# EAGLE schematic OutputBoard (EAGLE 7.1.0)
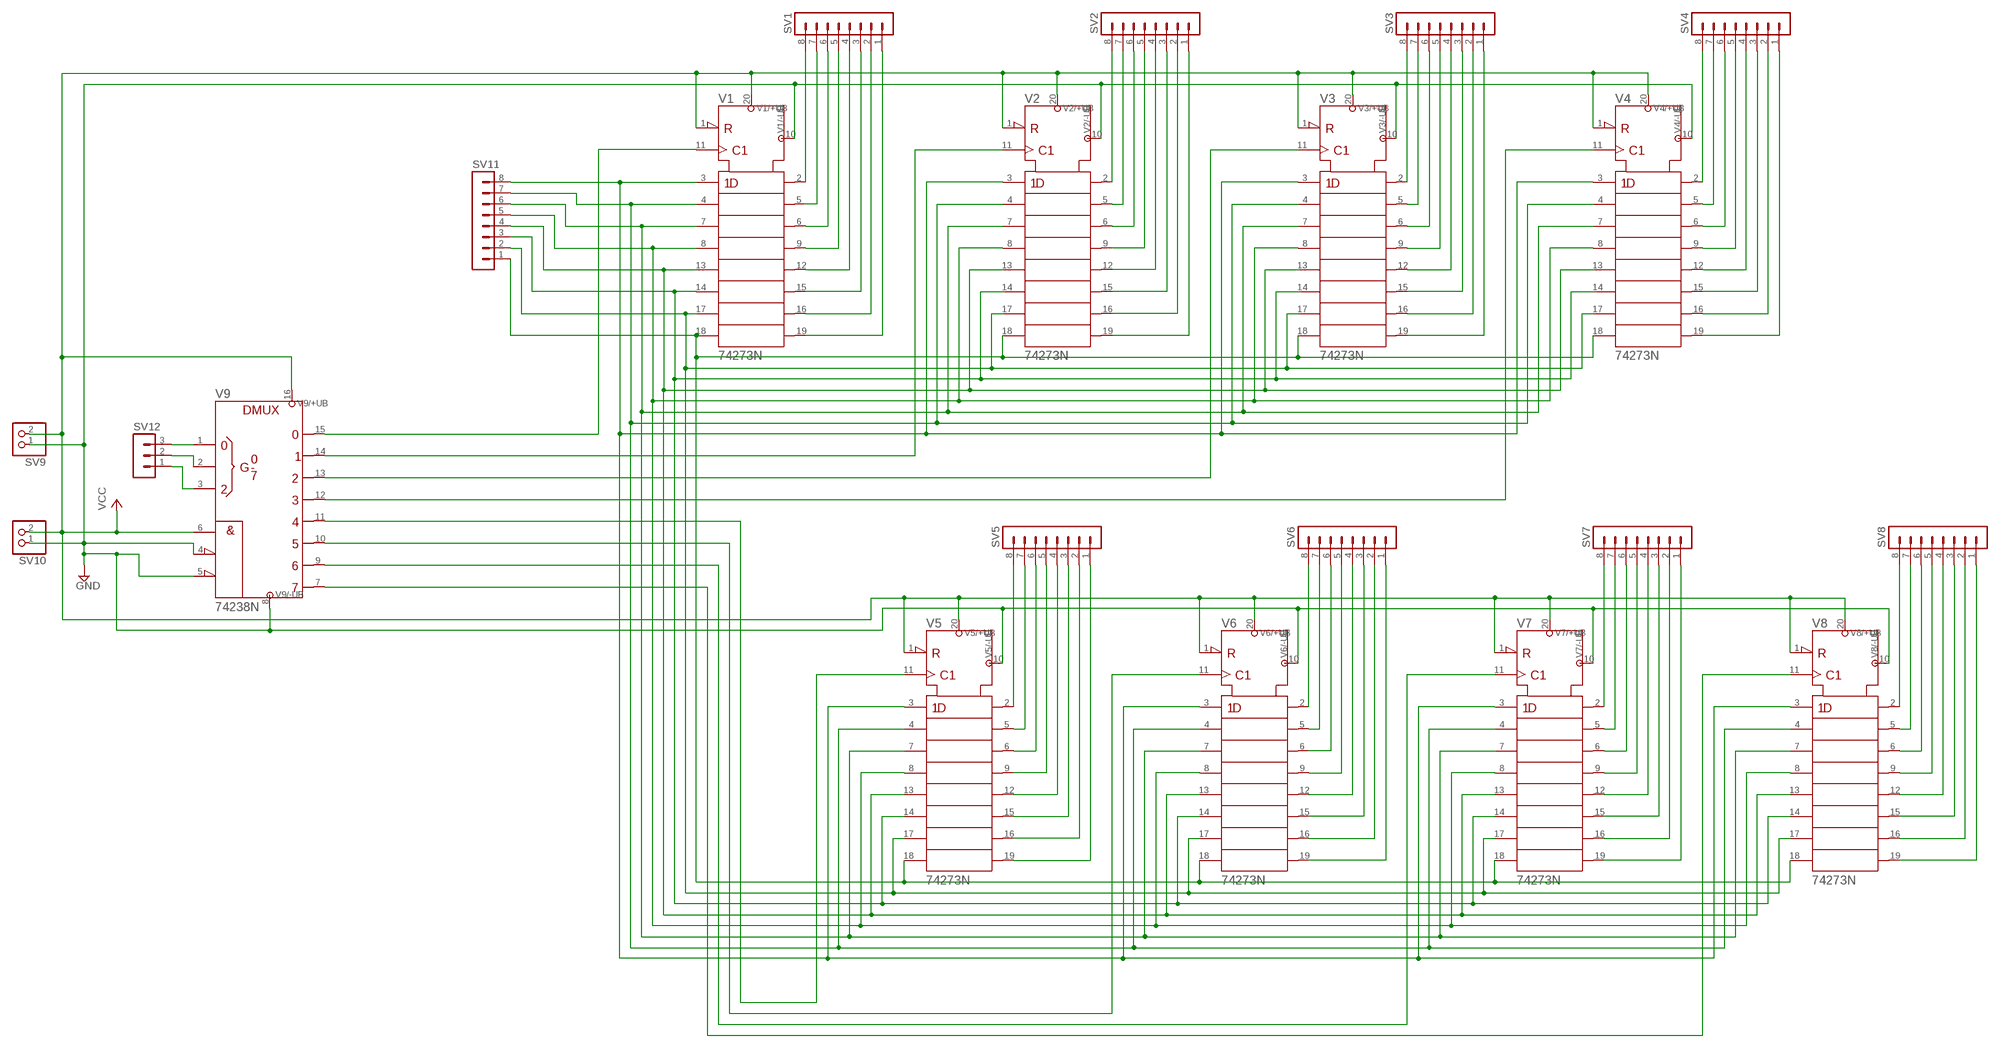
[diagram p0: schematic, sheet 1]

## Parts
SV1  MA08-1  [MA08-1]
SV2  MA08-1  [MA08-1]
SV3  MA08-1  [MA08-1]
SV4  MA08-1  [MA08-1]
SV5  MA08-1  [MA08-1]
SV6  MA08-1  [MA08-1]
SV7  MA08-1  [MA08-1]
SV8  MA08-1  [MA08-1]
SV9  PINHD-1X2  [1X02]
SV10  PINHD-1X2  [1X02]
SV11  MA08-1  [MA08-1]
SV12  MA03-1  [MA03-1]
V1  74273N  [DIL20]
V2  74273N  [DIL20]
V3  74273N  [DIL20]
V4  74273N  [DIL20]
V5  74273N  [DIL20]
V6  74273N  [DIL20]
V7  74273N  [DIL20]
V8  74273N  [DIL20]
V9  74238N  [DIL16]

## Nets
BUS1: SV11.8 V1.3(1D) V2.3(1D) V3.3(1D) V4.3(1D) V5.3(1D) V6.3(1D) V7.3(1D) V8.3(1D)
DATA1: SV11.1 V1.18(8D) V2.18(8D) V3.18(8D) V4.18(8D) V5.18(8D) V6.18(8D) V7.18(8D) V8.18(8D)
DATA2: SV11.2 V1.17(7D) V2.17(7D) V3.17(7D) V4.17(7D) V5.17(7D) V6.17(7D) V7.17(7D) V8.17(7D)
DATA3: SV11.3 V1.14(6D) V2.14(6D) V3.14(6D) V4.14(6D) V5.14(6D) V6.14(6D) V7.14(6D) V8.14(6D)
DATA8: SV11.4 V1.13(5D) V2.13(5D) V3.13(5D) V4.13(5D) V5.13(5D) V6.13(5D) V7.13(5D) V8.13(5D)
GND [Ground]: SV9.1 SV10.1 V1.10(-UB) V2.10(-UB) V3.10(-UB) V4.10(-UB) V5.10(-UB) V6.10(-UB) V7.10(-UB) V8.10(-UB) V9.4(!G2A) V9.5(!G2B) V9.8(-UB)
N$1: V3.11(CLK) V9.13(Y2)
N$2: SV2.8 V2.2(1Q)
N$3: V1.11(CLK) V9.15(Y0)
N$4: V2.11(CLK) V9.14(Y1)
N$5: SV2.7 V2.5(2Q)
N$6: SV2.6 V2.6(3Q)
N$7: SV2.5 V2.9(4Q)
N$8: SV2.4 V2.12(5Q)
N$9: SV2.3 V2.15(6Q)
N$10: SV2.2 V2.16(7Q)
N$11: SV2.1 V2.19(8Q)
N$12: SV1.8 V1.2(1Q)
N$13: SV12.2 V9.2(B)
N$14: SV12.1 V9.3(C)
N$15: SV5.8 V5.2(1Q)
N$16: SV1.7 V1.5(2Q)
N$17: SV1.6 V1.6(3Q)
N$18: SV1.5 V1.9(4Q)
N$19: SV1.4 V1.12(5Q)
N$20: SV12.3 V9.1(A)
N$21: SV5.7 V5.5(2Q)
N$22: SV5.6 V5.6(3Q)
N$23: SV1.3 V1.15(6Q)
N$24: SV1.2 V1.16(7Q)
N$25: SV1.1 V1.19(8Q)
N$26: V4.11(CLK) V9.12(Y3)
N$27: V5.11(CLK) V9.11(Y4)
N$28: V6.11(CLK) V9.10(Y5)
N$29: SV11.7 V1.4(2D) V2.4(2D) V3.4(2D) V4.4(2D) V5.4(2D) V6.4(2D) V7.4(2D) V8.4(2D)
N$30: SV3.8 V3.2(1Q)
N$31: SV3.7 V3.5(2Q)
N$32: SV3.6 V3.6(3Q)
N$33: SV3.5 V3.9(4Q)
N$34: SV3.4 V3.12(5Q)
N$35: SV3.3 V3.15(6Q)
N$36: SV3.2 V3.16(7Q)
N$37: SV3.1 V3.19(8Q)
N$38: SV4.8 V4.2(1Q)
N$39: SV4.7 V4.5(2Q)
N$40: SV4.6 V4.6(3Q)
N$41: SV4.5 V4.9(4Q)
N$42: SV4.4 V4.12(5Q)
N$43: SV4.3 V4.15(6Q)
N$44: SV4.2 V4.16(7Q)
N$45: SV4.1 V4.19(8Q)
N$46: SV11.6 V1.7(3D) V2.7(3D) V3.7(3D) V4.7(3D) V5.7(3D) V6.7(3D) V7.7(3D) V8.7(3D)
N$47: SV11.5 V1.8(4D) V2.8(4D) V3.8(4D) V4.8(4D) V5.8(4D) V6.8(4D) V7.8(4D) V8.8(4D)
N$48: SV6.8 V6.2(1Q)
N$49: SV6.7 V6.5(2Q)
N$50: SV6.6 V6.6(3Q)
N$51: SV6.5 V6.9(4Q)
N$52: SV6.4 V6.12(5Q)
N$53: SV6.3 V6.15(6Q)
N$54: SV6.2 V6.16(7Q)
N$55: SV6.1 V6.19(8Q)
N$56: SV7.8 V7.2(1Q)
N$57: SV7.7 V7.5(2Q)
N$58: SV7.6 V7.6(3Q)
N$59: SV7.5 V7.9(4Q)
N$60: SV7.4 V7.12(5Q)
N$61: SV7.3 V7.15(6Q)
N$62: SV7.2 V7.16(7Q)
N$63: SV7.1 V7.19(8Q)
N$64: V7.11(CLK) V9.9(Y6)
N$65: SV8.8 V8.2(1Q)
N$66: SV8.7 V8.5(2Q)
N$67: SV8.6 V8.6(3Q)
N$68: SV8.5 V8.9(4Q)
N$69: SV8.4 V8.12(5Q)
N$70: SV8.3 V8.15(6Q)
N$71: SV8.2 V8.16(7Q)
N$72: SV8.1 V8.19(8Q)
N$73: SV5.5 V5.9(4Q)
N$74: SV5.4 V5.12(5Q)
N$75: SV5.3 V5.15(6Q)
N$76: SV5.2 V5.16(7Q)
N$77: SV5.1 V5.19(8Q)
N$79: V8.11(CLK) V9.7(Y7)
VCC [VCC]: SV9.2 SV10.2 V1.1(!CLR) V1.20(+UB) V2.1(!CLR) V2.20(+UB) V3.1(!CLR) V3.20(+UB) V4.1(!CLR) V4.20(+UB) V5.1(!CLR) V5.20(+UB) V6.1(!CLR) V6.20(+UB) V7.1(!CLR) V7.20(+UB) V8.1(!CLR) V8.20(+UB) V9.6(G1) V9.16(+UB)

## Library data of the parts
SV1-SV8 SV11 = con-lstb:MA08-1: PIN HEADER; OC_FARNELL: unknown; OC_NEWARK: unknown
SV9 SV10 = pinhead:PINHD-1X2: PIN HEADER
SV12 = con-lstb:MA03-1: PIN HEADER; OC_FARNELL: unknown; OC_NEWARK: unknown
V1-V8 = 74ttl-din:74*273: Octal D type FLIP FLOP, clear
V9 = 74ttl-din:74*238: 1 of 8 noninverting DECODER/DEMULTIPLEXER

## Net classes
0 default: width 0.4 mm, drill 0.8 mm, clearance 0.2 mm
1 Ground: width 0.8 mm, drill 0.8 mm, clearance 0.2 mm
2 VCC: width 0.8 mm, drill 0.8 mm, clearance 0.2 mm